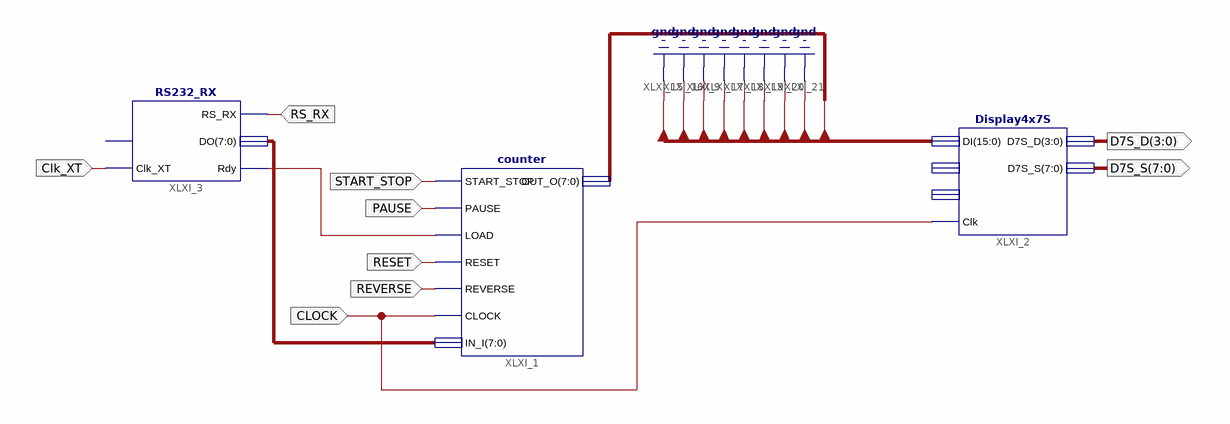
[diagram p0: schematic sheet 1]
// Xilinx ISE schematic przystawka.sch (xc9500xl) as structural Verilog: 3 symbols, 9 ports
module przystawka (
  input  RS_RX,
  input  START_STOP,
  input  PAUSE,
  input  RESET,
  input  REVERSE,
  input  CLOCK,
  input  Clk_XT,
  output [3:0] D7S_D,
  output [7:0] D7S_S
);

  wire XLXN_68;
  wire [7:0] DI, XLXN_6;

  counter XLXI_1 (
    .START_STOP(START_STOP), .PAUSE(PAUSE), .LOAD(XLXN_68), .RESET(RESET), .REVERSE(REVERSE), .CLOCK(CLOCK),
    .IN_I(XLXN_6), .OUT_O(DI));
  RS232_RX XLXI_3 (.Clk_XT(Clk_XT), .Rdy(XLXN_68), .DO(XLXN_6), .RS_RX(RS_RX));  // open: Reset
  Display4x7S XLXI_2 (.DI({{8{1'b0}}, DI}), .D7S_D(D7S_D), .D7S_S(D7S_S), .Clk(CLOCK));  // open: DP, Blank
endmodule
